# EAGLE schematic boardBase2 (EAGLE 8.4.0)
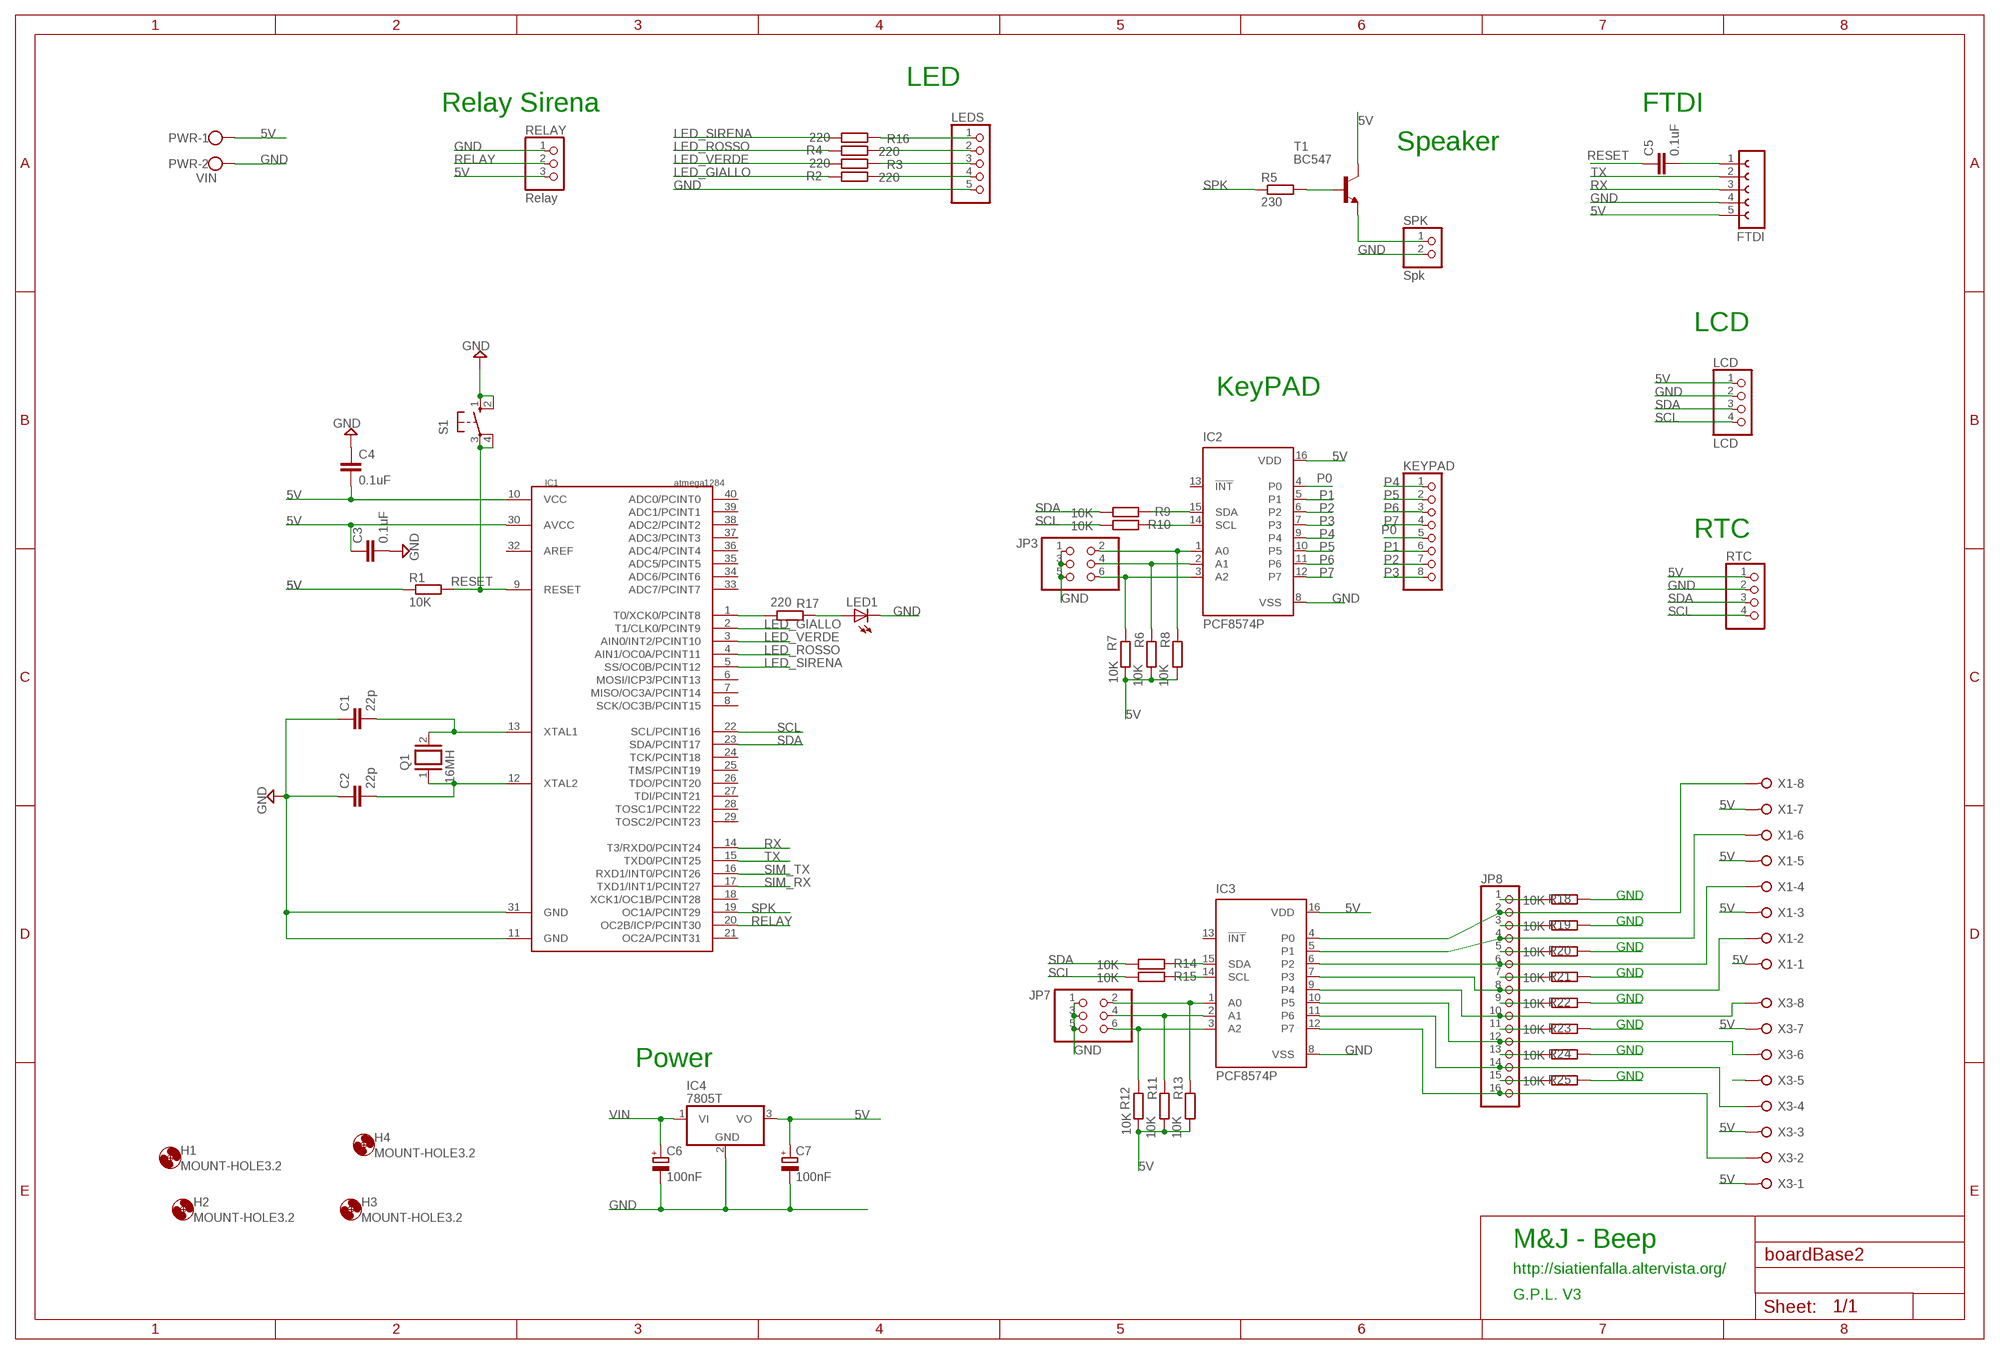
[diagram p0: schematic, sheet 1]

## Parts
C1  22p  C-EU025-024X044  [C025-024X044]
C2  22p  C-EU025-024X044  [C025-024X044]
C3  0.1uF  C-EU025-025X050  [C025-025X050]
C4  0.1uF  C-EU025-025X050  [C025-025X050]
C5  0.1uF  C-EU025-025X050  [C025-025X050]
C6  100nF  CPOL-EUE3.5-10  [E3,5-10]
C7  100nF  CPOL-EUE3.5-10  [E3,5-10]
FTDI  FE05-1  [FE05-1]
H1  MOUNT-HOLE3.2  [3,2]
H2  MOUNT-HOLE3.2  [3,2]
H3  MOUNT-HOLE3.2  [3,2]
H4  MOUNT-HOLE3.2  [3,2]
IC1  atmega1284  MEGA1284P  [DIL40]
IC2  PCF8574P  [DIL16]
IC3  PCF8574P  [DIL16]
IC4  7805T  [TO220H]
JP3  PINHD-2X3  [2X03]
JP7  PINHD-2X3  [2X03]
JP8  PINHD-1X16  [1X16]
KEYPAD  PINHD-1X8  [1X08]
LCD  LCD  PINHD-1X4  [1X04]
LED1  LED3MM  [LED3MM]
LEDS  PINHD-1X5  [1X05]
PWR  VIN  W237-102  [W237-102]
Q1  16MH  XTAL/S  [QS]
R1  10K  R-EU_0207/10  [0207/10]
R2  220  R-EU_0207/2V  [0207/2V]
R3  220  R-EU_0207/2V  [0207/2V]
R4  220  R-EU_0207/2V  [0207/2V]
R5  230  R-EU_0207/10  [0207/10]
R6  10K  R-EU_0207/10  [0207/10]
R7  10K  R-EU_0207/10  [0207/10]
R8  10K  R-EU_0207/10  [0207/10]
R9  10K  R-EU_0207/10  [0207/10]
R10  10K  R-EU_0207/10  [0207/10]
R11  10K  R-EU_0207/2V  [0207/2V]
R12  10K  R-EU_0207/2V  [0207/2V]
R13  10K  R-EU_0207/2V  [0207/2V]
R14  10K  R-EU_0207/2V  [0207/2V]
R15  10K  R-EU_0207/2V  [0207/2V]
R16  220  R-EU_0207/2V  [0207/2V]
R17  220  R-EU_0207/2V  [0207/2V]
R18  10K  R-EU_0207/2V  [0207/2V]
R19  10K  R-EU_0207/2V  [0207/2V]
R20  10K  R-EU_0207/2V  [0207/2V]
R21  10K  R-EU_0207/2V  [0207/2V]
R22  10K  R-EU_0207/2V  [0207/2V]
R23  10K  R-EU_0207/2V  [0207/2V]
R24  10K  R-EU_0207/2V  [0207/2V]
R25  10K  R-EU_0207/2V  [0207/2V]
RELAY  Relay  PINHD-1X3  [1X03]
RTC  PINHD-1X4  [1X04]
S1  10-XX  [B3F-10XX]
SPK  Spk  PINHD-1X2  [1X02]
T1  BC547  [TO92]
X1  W237-08P  [W237-8P]
X3  W237-08P  [W237-8P]

## Nets
5V: C3.1 C4.2 C7.+ FTDI.5 IC1.10(VCC) IC1.30(AVCC) IC2.16(VDD) IC3.16(VDD) IC4.3(VO) LCD.1 PWR.1 R1.1 R6.1 R7.2 R8.1 R11.1 R12.2 R13.1 RELAY.3 RTC.1 T1.3(C) X1.1 X1.3 X1.5 X1.7 X3.1 X3.3 X3.5 X3.7
GND: C1.1 C2.1 C3.2 C4.1 C6.- C7.- FTDI.4 IC1.11(GND) IC1.31(GND) IC2.8(VSS) IC3.8(VSS) IC4.2(GND) JP3.1 JP3.3 JP3.5 JP7.1 JP7.3 JP7.5 LCD.2 LED1.K(C) LEDS.5 PWR.2 R18.1 R19.1 R21.1 R22.1 R23.1 R24.1 R25.1 RELAY.1 RTC.2 S1.1(S) S1.2(S1) SPK.2
LED_GIALLO: IC1.2(T1/CLK0/PCINT9) R2.2
LED_ROSSO: IC1.4(AIN1/OC0A/PCINT11) R4.2
LED_SIRENA: IC1.5(SS/OC0B/PCINT12) R16.1
LED_VERDE: IC1.3(AIN0/INT2/PCINT10) R3.1
N$1: C2.2 IC1.12(XTAL2) Q1.1
N$2: C1.2 IC1.13(XTAL1) Q1.2
N$3: IC2.1(A0) JP3.2 R8.2
N$4: C5.2 FTDI.1
N$5: IC2.2(A1) JP3.4 R6.2
N$6: IC2.3(A2) JP3.6 R7.1
N$7: LEDS.4 R2.1
N$8: LEDS.3 R3.2
N$9: LEDS.2 R4.1
N$10: IC2.14(SCL) R10.1
N$11: R5.2 T1.2(B)
N$12: SPK.1 T1.1(E)
N$13: IC2.15(SDA) R9.1
N$14: IC3.1(A0) JP7.2 R13.2
N$15: IC3.2(A1) JP7.4 R11.2
N$16: IC3.3(A2) JP7.6 R12.1
N$17: IC3.14(SCL) R15.1
N$18: IC3.15(SDA) R14.1
N$19: LEDS.1 R16.2
N$20: IC1.1(T0/XCK0/PCINT8) R17.1
N$21: LED1.A R17.2
N$22: IC3.4(P0) JP8.2 X1.8
N$23: IC3.5(P1) JP8.4 X1.6
N$24: IC3.6(P2) JP8.6 X1.4
N$25: IC3.7(P3) JP8.8 X1.2
N$26: IC3.9(P4) JP8.10 X3.8
N$27: IC3.10(P5) JP8.12 X3.6
N$28: IC3.11(P6) JP8.14 X3.4
N$29: IC3.12(P7) JP8.16 X3.2
N$30: JP8.1 R18.2
N$31: JP8.3 R19.2
N$32: JP8.5 R20.2
N$33: JP8.7 R21.2
N$34: JP8.9 R22.2
N$35: JP8.11 R23.2
N$36: JP8.13 R24.2
N$37: JP8.15 R25.2
N$40: R20.1
P0: IC2.4(P0) KEYPAD.5
P1: IC2.5(P1) KEYPAD.6
P2: IC2.6(P2) KEYPAD.7
P3: IC2.7(P3) KEYPAD.8
P4: IC2.9(P4) KEYPAD.1
P5: IC2.10(P5) KEYPAD.2
P6: IC2.11(P6) KEYPAD.3
P7: IC2.12(P7) KEYPAD.4
RELAY: IC1.20(OC2B/ICP/PCINT30) RELAY.2
RESET: C5.1 IC1.9(RESET) R1.2 S1.3(P) S1.4(P1)
RX: FTDI.3 IC1.14(T3/RXD0/PCINT24)
SCL: IC1.22(SCL/PCINT16) LCD.4 R10.2 R15.2 RTC.4
SDA: IC1.23(SDA/PCINT17) LCD.3 R9.2 R14.2 RTC.3
SIM_RX: IC1.17(TXD1/INT1/PCINT27)
SIM_TX: IC1.16(RXD1/INT0/PCINT26)
SPK: IC1.19(OC1A/PCINT29) R5.1
TX: FTDI.2 IC1.15(TXD0/PCINT25)
VIN: C6.+ IC4.1(VI)
Unconnected: IC1.6(MOSI/ICP3/PCINT13) IC1.7(MISO/OC3A/PCINT14) IC1.8(SCK/OC3B/PCINT15) IC1.18(XCK1/OC1B/PCINT28) IC1.21(OC2A/PCINT31) IC1.24(TCK/PCINT18) IC1.25(TMS/PCINT19) IC1.26(TDO/PCINT20) IC1.27(TDI/PCINT21) IC1.28(TOSC1/PCINT22) IC1.29(TOSC2/PCINT23) IC1.32(AREF) IC1.33(ADC7/PCINT7) IC1.34(ADC6/PCINT6) IC1.35(ADC5/PCINT5) IC1.36(ADC4/PCINT4) IC1.37(ADC3/PCINT3) IC1.38(ADC2/PCINT2) IC1.39(ADC1/PCINT1) IC1.40(ADC0/PCINT0) IC2.13(!INT) IC3.13(!INT)

## Notes on the sheet
- LED
- Relay Sirena | FTDI
- Speaker
- LCD
- KeyPAD
- RTC
- GND
- GND
- GND
- GND
- GND
- GND
- GND
- Power
- GND
- M&J - Beep
- http://siatienfalla.altervista.org/
- G.P.L. V3

## Library data of the parts
C1-C5 = rcl:C-EU: CAPACITOR, European symbol
C6 C7 = rcl:CPOL-EU: POLARIZED CAPACITOR, European symbol
FTDI = con-lsta:FE05-1: FEMALE HEADER; OC_FARNELL: unknown; OC_NEWARK: unknown
H1-H4 = holes:MOUNT-HOLE: MOUNTING HOLE with drill center marker
IC1 = 1284p:MEGA1284P: Atmel ATmega1284P 8-bit AVR Microcontroller
IC2 IC3 = micro-philips:PCF8574: I2C-Bus Remote 8-bit I/O expander http://www.semiconductors.philips.com/acrobat_download/datasheets/PCF8574_4.pdf; MPN: PCF8574PN; OC_FARNELL: 204020; OC_NEWARK: 11N8515
IC4 = linear:78*: Positive VOLTAGE REGULATOR Source: http://cache.national.com/ds/LM/LM78L05.pdf http://www.fairchildsemi.com/ds/LM/LM7805.pdf
JP3 JP7 = pinhead:PINHD-2X3: PIN HEADER
JP8 = pinhead:PINHD-1X16: PIN HEADER
KEYPAD = pinhead:PINHD-1X8: PIN HEADER
LCD RTC = pinhead:PINHD-1X4: PIN HEADER
LED1 = led:LED: LED OSRAM: - CHIPLED LG R971, LG N971, LY N971, LG Q971, LY Q971, LO R971, LY R971 LH N974, LH R974 LS Q976, LO Q976, LY Q976 LO Q996 - Hyper CHIPLED LW Q18S LB Q993, LB Q99A, LB R99A - SideLED LS A670, LO A670, LY A670, LG A670, LP A670 LB A673, LV A673, LT A673, LW A673 LH A674 LY A675 LS A676, LA A676, LO A676, LY A676, LW A676 LS A679, LY A679, LG A679 - Hyper Micro SIDELED® LS Y876, LA Y876, LO Y876, LY Y876 LT Y87S - SmartLED LW L88C, LW L88S LB L89C, LB L89S, LG L890 LS L89K, LO L89K, LY L89K LS L896, LA L896, LO L896, LY L896 - TOPLED LS T670, LO T670, LY T670, LG T670, LP T670 LSG T670, LSP T670, LSY T670, LOP T670, LYG T670 LG T671, LOG T671, LSG T671 LB T673, LV T673, LT T673, LW T673 LH T674 LS T676, LA T676, LO T676, LY T676, LB T676, LH T676, LSB T676, LW T676 LB T67C, LV T67C, LT T67C, LS T67K, LO T67K, LY T67K, LW E67C LS E67B, LA E67B, LO E67B, LY E67B, LB E67C, LV E67C, LT E67C LW T67C LS T679, LY T679, LG T679 LS T770, LO T770, LY T770, LG T770, LP T770 LB T773, LV T773, LT T773, LW T773 LH T774 LS E675, LA E675, LY E675, LS T675 LS T776, LA T776, LO T776, LY T776, LB T776 LHGB T686 LT T68C, LB T68C - Hyper Mini TOPLED® LB M676 - Mini TOPLED Santana® LG M470 LS M47K, LO M47K, LY M47K Source: http://www.osram.convergy.de LUXEON: - LUMILED® LXK2-PW12-R00, LXK2-PW12-S00, LXK2-PW14-U00, LXK2-PW14-V00 LXK2-PM12-R00, LXK2-PM12-S00, LXK2-PM14-U00 LXK2-PE12-Q00, LXK2-PE12-R00, LXK2-PE12-S00, LXK2-PE14-T00, LXK2-PE14-U00 LXK2-PB12-K00, LXK2-PB12-L00, LXK2-PB12-M00, LXK2-PB14-N00, LXK2-PB14-P00, LXK2-PB14-Q00 LXK2-PR12-L00, LXK2-PR12-M00, LXK2-PR14-Q00, LXK2-PR14-R00 LXK2-PD12-Q00, LXK2-PD12-R00, LXK2-PD12-S00 LXK2-PH12-R00, LXK2-PH12-S00 LXK2-PL12-P00, LXK2-PL12-Q00, LXK2-PL12-R00 Source: www.luxeon.com KINGBRIGHT: KA-3528ASYC Source: www.kingbright.com
LEDS = pinhead:PINHD-1X5: PIN HEADER
PWR = con-wago-500:W237-102: WAGO SCREW CLAMP; MPN: 237-102; OC_FARNELL: unknown; OC_NEWARK: 70K9898
Q1 = special:XTAL/S: CRYSTAL
R1-R25 = rcl:R-EU_: RESISTOR, European symbol
RELAY = pinhead:PINHD-1X3: PIN HEADER
S1 = switch-omron:10-XX: OMRON SWITCH; MPN: B3F-1000; OC_FARNELL: 176432; OC_NEWARK: 36M3542
SPK = pinhead:PINHD-1X2: PIN HEADER
T1 = transistor:BC547: NPN TRANSISTOR
X1 X3 = con-wago-508:W237-08P: WAGO SREW CLAMP; OC_FARNELL: unknown; OC_NEWARK: unknown